# Altium schematic sheet Power.SchDoc: Power
size A4; DocumentNumber: 8; SheetNumber: 8; SheetTotal: 8
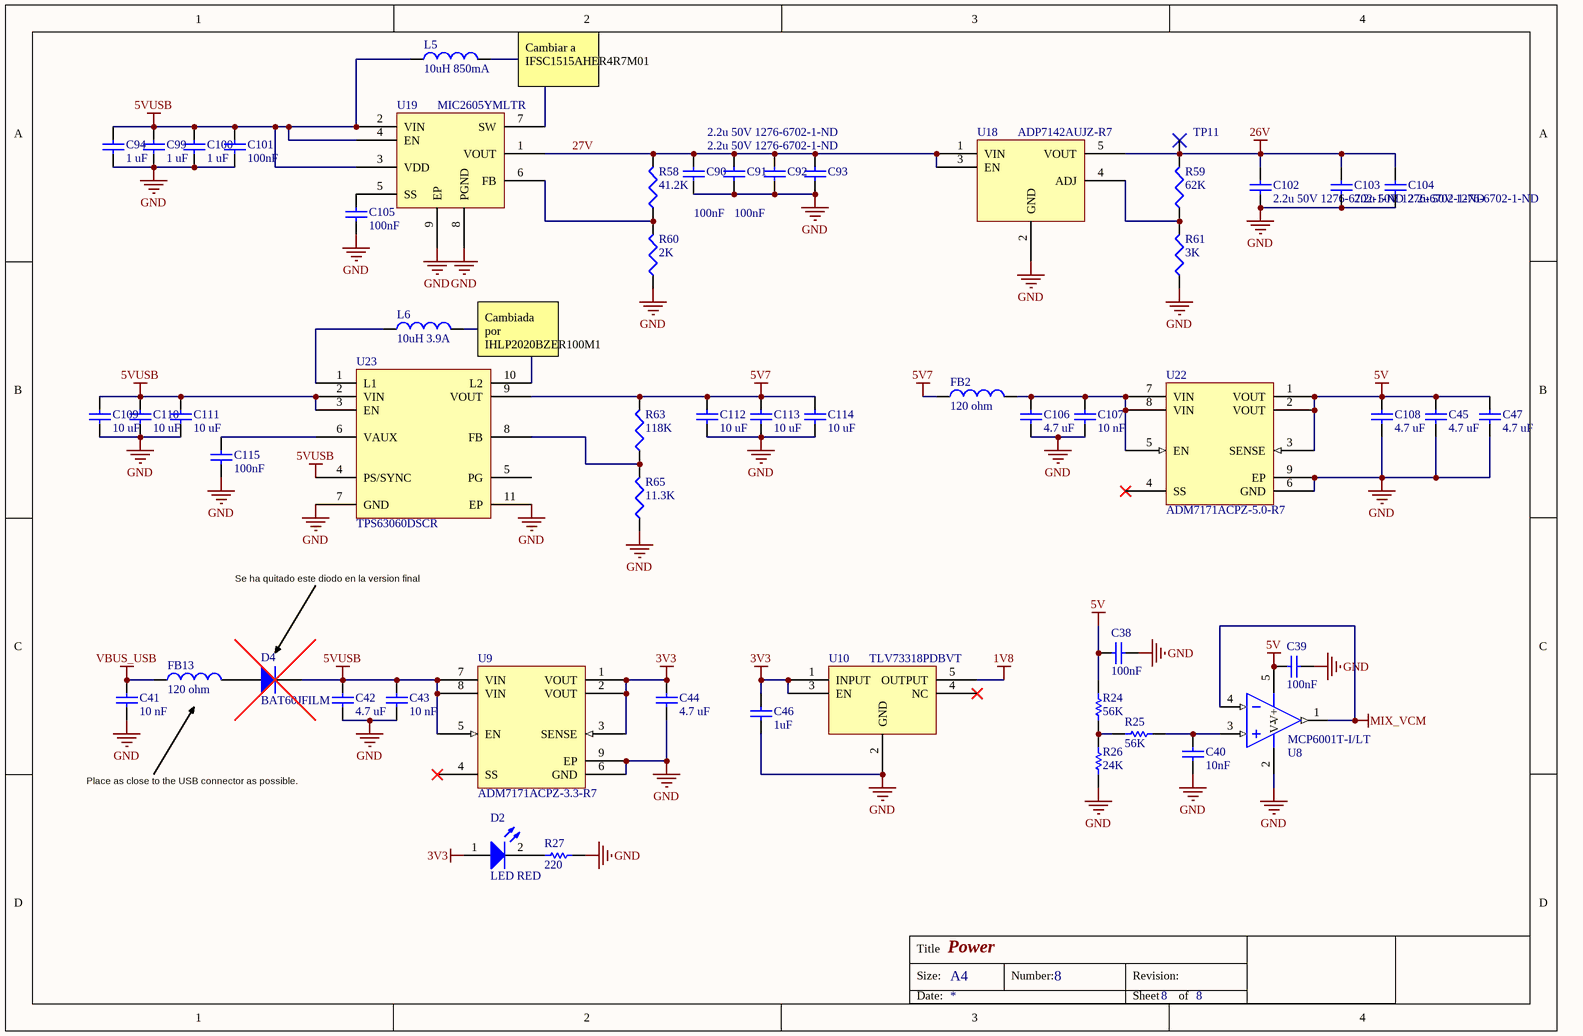
[diagram p0: Power.SchDoc]

## Parts
C38  100nF  [0603 Cap]
C39  100nF  [0603 Cap]
C40  10nF  [0603 Cap]
C41  10 nF  [Chip2PinSM127P600-8N_CAP0402]
C42  4.7 uF  [CAPC1608X10L]
C43  10 nF  [Chip2PinSM127P600-8N_CAP0402]
C44  4.7 uF  [CAPC1608X10L]
C45  4.7 uF  [CAPC1608X10L]
C46  1uF  [0603 Cap]
C47  4.7 uF  [CAPC1608X10L]
C90  100nF  [0603 Cap]
C91  100nF  [0603 Cap]
C92  2.2u 50V 1276-6702-1-ND  [0805 CAP]
C93  2.2u 50V 1276-6702-1-ND  [0805 CAP]
C94  1 uF  [CAPC2012X08L]
C99  1 uF  [CAPC2012X08L]
C100  1 uF  [CAPC2012X08L]
C101  100nF  [0603 Cap]
C102  2.2u 50V 1276-6702-1-ND  [0805 CAP]
C103  2.2u 50V 1276-6702-1-ND  [0805 CAP]
C104  2.2u 50V 1276-6702-1-ND  [0805 CAP]
C105  100nF  [0603 Cap]
C106  4.7 uF  [CAPC1608X10L]
C107  10 nF  [Chip2PinSM127P600-8N_CAP0402]
C108  4.7 uF  [CAPC1608X10L]
C109  10 uF  [CAPC2012X08L]
C110  10 uF  [CAPC2012X08L]
C111  10 uF  [CAPC2012X08L]
C112  10 uF  [CAPC2012X08L]
C113  10 uF  [CAPC2012X08L]
C114  10 uF  [CAPC2012X08L]
C115  100nF  [0603 Cap]
D2  LED RED  [0603 LED]
D4  BAT60JFILM  [SODFL250X117-2N]
FB2  120 ohm  [INDC1608X08L]
FB13  120 ohm  [INDC1608X08L]
L5  10uH 850mA  [INDP4040X20N]
L6  10uH 3.9A  [INDP8080X45N]
R24  56K  [0603 Res]
R25  56K  [0603 Res]
R26  24K  [0603 Res]
R27  220  [0603 Res]
R58  41.2K  [J1-0603]
R59  62K  [J1-0603]
R60  2K  [J1-0603]
R61  3K  [J1-0603]
R63  118K  [J1-0603]
R65  11.3K  [J1-0603]
TP11  TEST_POINT_PIN  [TESTPOINT 1mm]  (value not drawn)  (no BOM)
U8  MCP6001T-I/LT  [SC70P210X110-5L]
U9  ADM7171ACPZ-3.3-R7  [SON50P300X80_HS-9N LFCSP_WD Analog]
U10  TLV73318PDBVT  [SOT95P280X110-5N]
U18  ADP7142AUJZ-R7  [SOT95P280X90-5N]
U19  MIC2605YMLTR  [SON50P200X90_HS-9N]
U22  ADM7171ACPZ-5.0-R7  [SON50P300X80_HS-9N LFCSP_WD Analog]
U23  TPS63060DSCR  [SON50P300X80_HS-11N]

## Nets
1V8: U10.5(OUTPUT)
3V3: C44.2 C46.2 D2.1(A) U9.1(VOUT) U9.2(VOUT) U9.3(SENSE) U10.1(INPUT) U10.3(EN)
5V: C38.1 C39.1 C45.2 C47.2 C108.2 R24.2 U8.5(V+) U22.1(VOUT) U22.2(VOUT) U22.3(SENSE)
5V7: C112.2 C113.2 C114.2 FB2.1 R63.2 U23.9(VOUT)
5VUSB: C42.2 C43.2 C94.2 C99.2 C100.2 C101.2 C109.1 C110.2 C111.2 D4.1(K) L5.1 U9.5(EN) U9.7(VIN) U9.8(VIN) U19.2(VIN) U19.3(VDD) U19.4(EN) U23.2(VIN) U23.3(EN) U23.4(PS/SYNC)
26V: C102.2 C103.2 C104.2 R59.2 TP11.1 U18.5(VOUT)
GND: C38.2 C39.2 C40.1 C41.1 C42.1 C43.1 C44.1 C45.1 C46.1 C47.1 C90.1 C91.1 C92.1 C93.1 C94.1 C99.1 C100.1 C101.1 C102.1 C103.1 C104.1 C105.1 C106.1 C107.1 C108.1 C109.2 C110.1 C111.1 C112.1 C113.1 C114.1 C115.1 R26.1 R27.2 R60.1 R61.1 R65.1 U8.2(V-) U9.6(GND) U9.9(EP) U10.2(GND) U18.2(GND) U19.8(PGND) U19.9(EP) U22.6(GND) U22.9(EP) U23.7(GND) U23.11(EP)
MIX_VCM: U8.1(OUT) U8.4(IN-)
VBUS_USB: C41.2 FB13.1
27V: C90.2 C91.2 C92.2 C93.2 R58.2 U18.1(VIN) U18.3(EN) U19.1(VOUT)
NetC40_2: C40.2 R25.1 U8.3(IN+)
NetC105_2: C105.2 U19.5(SS)
NetC106_2: C106.2 C107.2 FB2.2 U22.5(EN) U22.7(VIN) U22.8(VIN)
NetC115_2: C115.2 U23.6(VAUX)
NetD2_2: D2.2(C) R27.1
NetD4_2: D4.2(A) FB13.2
NetL5_2: L5.2 U19.7(SW)
NetL6_1: L6.1 U23.1(L1)
NetL6_2: L6.2 U23.10(L2)
NetR24_1: R24.1 R25.2 R26.2
NetR58_1: R58.1 R60.2 U19.6(FB)
NetR59_1: R59.1 R61.2 U18.4(ADJ)
NetR63_1: R63.1 R65.2 U23.8(FB)

Not connected (* = marked no-connect by the designer): U9 4(SS)*; U10 4(NC)*; U22 4(SS)*; U23 5(PG)

## Notes on the sheet
- Cambiar a IFSC1515AHER4R7M01
- Cambiada por IHLP2020BZER100M1
- Se ha quitado este diodo en la version final
- Place as close to the USB connector as possible.
- Title
- Size:
- A4
- Number:
- Revision:
- Date:
- Sheet
- of

## Library data of the parts
C38-C40 = C_0603: CAP CER 16V X7R 0603; Tolerance: 10; Voltage Rating: 16; Material: Ceramic; Mount: Surface Mount; Case/Package: 0603; Case Code (Metric): 1608; Case Code (Imperial): 0603; Capacitance: *; Dielectric: X7R; Voltage Rating (DC): 16; Termination: SMD; Composition: Ceramic; Voltage: 16; Length: 1.6; Height: 0.8; Width: 0.8; Thickness: 0.035; Depth: 0.8
C41 C43 C107 = CL05B103KA5NNNC: CAP CER 10000PF 25V X7R 0402; Manufacturer: Samsung Electro-Mechanics America, Inc.; Tolerance: ±10%; Supplier 1: Digi-Key; Manufacturer Part Number: CL05B103KA5NNNC; RoHS: RoHS Compliant; Category: Capacitors; Stock 1: 615673; Pricing 1: 1=0.09, 10=0.009, 25=0.006, 50=0.0044, 100=0.0037, 250=0.00308, 500=0.00266, 1000=0.00208, 5000=0.00174 (EUR); Packaging: Cut Tape (CT); Part Status: Active; Capacitance: 10000pF; Voltage - Rated: 25V; Temperature Coefficient: X7R; Operating Temperature: -55°C ~ 125°C; Features: -; Ratings: -; Applications: General Purpose; Mounting Type: Surface Mount, MLCC; Package / Case: 0402 (1005 Metric); Size / Dimension: 0.039" L x 0.020" W (1.00mm x 0.50mm); Height - Seated (Max): -; Thickness (Max): 0.022" (0.55mm); Lead Spacing: -; Lead Style: -; ComponentLink1URL: http://www.samsungsem.com/kr/support/product-search/mlcc/__icsFiles/afieldfile/2016/08/18/S_CL05B103KA5NNNC.pdf; ComponentLink1Description: http://www.samsungsem.com/kr/support/product-search/mlcc/__icsFiles/afieldfile/2016/08/18/S_CL05B103KA5NNNC.pdf; Supplier Part Number 1: 1276-1057-1-ND
C42 C44 C45 C47 C106 C108 = GRM188R61C475KAAJD: Multilayer Ceramic Capacitors MLCC - SMD/SMT 0603 4.7uF 16volts X5R + - 10%; Manufacturer: Murata Electronics; Type: General Purpose MLCC; Voltage Rating DC: 16 V; Product Status: New Product; Voltage - Rated: 16V; Supplier 1: Mouser; Manufacturer Part Number: GRM188R61C475KAAJD; RoHS: RoHS Compliant; Category: Multilayer Ceramic Capacitors MLCC - SMD/SMT; Stock 1: 10870; Pricing 1: 1=0.262, 10=0.110, 100=0.066, 1000=0.056, 4000=0.042, 8000=0.040, 24000=0.037, 48000=0.035, 100000=0.030 (EUR); Capacitance: 4.7 uF; Height: 0.8 mm; Length: 1.6 mm; Package/Case: 0603 (1608 metric); Packaging: Reel; Product: General Type MLCCs; Series: GRM; Termination Style: SMD/SMT; Tolerance: 10 %; Width: 0.8 mm; Brand: Murata Electronics; Case Code - in: 0603; Case Code - mm: 1608; Dielectric: X5R; Maximum Operating Temperature: + 85 C; Minimum Operating Temperature: - 55 C; RoHS - Mouser: Y; Minimum Order Quantity: 1; Reeling: True; ComponentLink1URL: http://www.mouser.com/ds/2/281/c02e-2905.pdf; ComponentLink1Description: http://www.mouser.com/ds/2/281/c02e-2905.pdf; Supplier 2: Digi-Key; Stock 2: 0; Pricing 2: 1=0.27, 10=0.224, 25=0.154, 50=0.1262, 100=0.112, 250=0.08404, 500=0.07424, 1000=0.06582 (EUR); Temperature Coefficient: X5R; Mounting Type: Surface Mount, MLCC; Operating Temperature: -55°C ~ 85°C; Applications: General Purpose; Ratings: -; Package / Case: 0603 (1608 Metric); Size / Dimension: 0.063" L x 0.031" W (1.60mm x 0.80mm); Height - Seated (Max): -; Thickness (Max): 0.037" (0.95mm); Lead Spacing: -; Features: -; Lead Style: -; ComponentLink2URL: http://www.murata.com/~/media/webrenewal/support/library/catalog/products/capacitor/mlcc/c02e.ashx; ComponentLink2Description: http://www.murata.com/~/media/webrenewal/support/library/catalog/products/capacitor/mlcc/c02e.ashx; Supplier Part Number 1: 81-GRM188R61C475KAJD; Supplier Part Number 2: 490-10481-1-ND
C46 = CL10B105MO8NNWC: CAP CER 1UF 16V X7R 0603; Manufacturer: Samsung Electro-Mechanics America, Inc.; Capacitance: 1µF; Tolerance: ±20%; Supplier 1: Digi-Key; Manufacturer Part Number: CL10B105MO8NNWC; RoHS: RoHS Compliant; Category: Capacitors; Stock 1: 77746; Pricing 1: 1=0.09, 10=0.02, 25=0.0144, 50=0.0108, 100=0.0089, 250=0.00744, 500=0.00636, 1000=0.00499 (EUR); Packaging: Digi-Reel®; Part Status: Active; Voltage - Rated: 16V; Temperature Coefficient: X7R; Operating Temperature: -55°C ~ 125°C; Features: -; Ratings: -; Applications: General Purpose; Mounting Type: Surface Mount, MLCC; Package / Case: 0603 (1608 Metric); Size / Dimension: 0.063" L x 0.031" W (1.60mm x 0.80mm); Height - Seated (Max): -; Thickness (Max): 0.035" (0.90mm); Lead Spacing: -; Lead Style: -; ComponentLink1URL: http://www.samsungsem.com/kr/support/library/product-catalog/__icsFiles/afieldfile/2016/09/27/MLCC.pdf; ComponentLink1Description: http://www.samsungsem.com/kr/support/library/product-catalog/__icsFiles/afieldfile/2016/09/27/MLCC.pdf; Supplier Part Number 1: 1276-6524-6-ND
C90 C91 C101 C105 C115 = C0603C104K4RACTU: CAP CER 0.1UF 16V X7R 0603; Manufacturer: KEMET; Capacitance: 0.1µF; Tolerance: ±10%; Supplier 1: Digi-Key; Manufacturer Part Number: C0603C104K4RACTU; RoHS: RoHS Compliant; Category: Capacitors; Stock 1: 4491346; Pricing 1: 1=0.09, 10=0.022, 25=0.016, 50=0.0122, 100=0.01, 250=0.00836, 500=0.0071, 1000=0.00559 (EUR); Packaging: Digi-Reel®; Part Status: Active; Voltage - Rated: 16V; Temperature Coefficient: X7R; Operating Temperature: -55°C ~ 125°C; Features: -; Ratings: -; Applications: General Purpose; Failure Rate: -; Mounting Type: Surface Mount, MLCC; Package / Case: 0603 (1608 Metric); Size / Dimension: 0.063" L x 0.031" W (1.60mm x 0.80mm); Height - Seated (Max): -; Thickness (Max): 0.034" (0.87mm); Lead Spacing: -; Lead Style: -; ComponentLink1URL: http://www.kemet.com/docfinder?Partnumber=C0603C104K4RACTU; ComponentLink1Description: http://www.kemet.com/docfinder?Partnumber=C0603C104K4RACTU; Supplier Part Number 1: 399-1096-6-ND
C92 C93 C102-C104 = C0805C335K4PACTU: Multilayer Ceramic Capacitors MLCC - SMD/SMT 16volts 3.3uF X5R 10%; Manufacturer: Kemet; Capacitance: 3.3; Tolerance: 10; Voltage Rating (DC): 16; Dissipation Factor: 5; Supplier 1: Digikey; Manufacturer Part Number: C0805C335K4PACTU; Stock 1: 7901; Pricing 1: 1=0.4, 10=0.281, 25=0.2304, 50=0.1966, 100=0.1685, 250=0.1404, 500=0.1263, 1000=0.1067 (USD); Mount: Surface Mount; Case/Package: 0805; Case Code (Metric): 2012; Case Code (Imperial): 0805; Min Operating Temperature: -55; Max Operating Temperature: 85; Packaging: Tape and Reel; Dielectric: X5R; Voltage Rating: 16; Package Quantity: 2500; Lead Pitch: 0.75; Termination: SMD; Voltage: 16; Length: 2; Height: 1.25; Depth: 1.25; Width: 0.049; Thickness: 0.055; Radiation Hardening: No; Lead Free: Lead Free; REACH SVHC: No SVHC; ComponentLink1URL: https://datasheet.ciiva.com/22705/1847039-22705464.pdf; ComponentLink1Description: https://datasheet.ciiva.com/22705/1847039-22705464.pdf; ComponentLink2URL: https://datasheet.ciiva.com/7842/1847039-7842327.pdf; ComponentLink2Description: https://datasheet.ciiva.com/7842/1847039-7842327.pdf; Supplier Part Number 1: 399-8073-1-ND
C94 C99 C100 = CL21B105KAFNNNE: CAP CER 1UF 25V 10% X7R 0805; Manufacturer: Samsung Electro-Mechanics America, Inc; Capacitance: 1.0µF; Supplier 1: Digi-Key; Supplier Part Number 1: 1276-1066-1-ND; Manufacturer Part Number: CL21B105KAFNNNE; RoHS: RoHS Compliant; Category: Capacitors; Stock 1: 446779; Pricing 1: 1=0.11, 10=0.077, 25=0.054, 100=0.0349, 500=0.02446, 1000=0.01906 (EUR); Packaging: Cut Tape (CT); Tolerance: ±10%; Voltage - Rated: 25V; Temperature Coefficient: X7R; Mounting Type: Surface Mount, MLCC; Operating Temperature: -55°C ~ 125°C; Applications: General Purpose; Ratings: -; Package / Case: 0805 (2012 Metric); Size / Dimension: 0.079" L x 0.049" W (2.00mm x 1.25mm); Height - Seated (Max): -; Thickness (Max): 0.053" (1.35mm); Lead Spacing: -; Features: -; Lead Style: -; ComponentLink1URL: http://www.samsungsem.com/servlet/FileDownload?type=spec&file=CL21B105KAFNNNE.pdf; ComponentLink1Description: http://www.samsungsem.com/servlet/FileDownload?type=spec&file=CL21B105KAFNNNE.pdf
C109-C114 = CL21A106KAYNNNE: CAP CER 10UF 25V 10% X5R 0805; Manufacturer: Samsung Electro-Mechanics America, Inc; Capacitance: 10µF; Supplier 1: Digi-Key; Supplier Part Number 1: 1276-2891-1-ND; Manufacturer Part Number: CL21A106KAYNNNE; RoHS: RoHS Compliant; Category: Capacitors; Stock 1: 406675; Pricing 1: 1=0.22, 10=0.18, 25=0.124, 100=0.0901, 500=0.0597, 1000=0.05293 (EUR); Packaging: Cut Tape (CT); Tolerance: ±10%; Voltage - Rated: 25V; Temperature Coefficient: X5R; Mounting Type: Surface Mount, MLCC; Operating Temperature: -55°C ~ 85°C; Applications: General Purpose; Ratings: -; Package / Case: 0805 (2012 Metric); Size / Dimension: 0.079" L x 0.049" W (2.00mm x 1.25mm); Height - Seated (Max): -; Thickness (Max): 0.057" (1.45mm); Lead Spacing: -; Features: -; Lead Style: -; ComponentLink1URL: http://www.samsungsem.com/servlet/FileDownload?type=spec&file=CL21A106KAYNNNE.pdf; ComponentLink1Description: http://www.samsungsem.com/servlet/FileDownload?type=spec&file=CL21A106KAYNNNE.pdf
D2 = LTST-C191KRKT: LED RED CLEAR 0603 SMD; Manufacturer: Lite-On Inc.; Lens Color: Colorless; Millicandela Rating: 54mcd; Lens Style/Size: Rectangle with Flat Top, 1.10mm x 0.80mm; Voltage - Forward (Vf) (Typ): 2V; Current - Test: 20mA; Viewing Angle: 130°; Wavelength - Dominant: 631nm; Wavelength - Peak: 639nm; Supplier 1: Digi-Key; Manufacturer Part Number: LTST-C191KRKT; RoHS: RoHS Compliant; Category: Optoelectronics; Stock 1: 517799; Pricing 1: 1=0.27, 10=0.197, 25=0.1456, 100=0.1039, 250=0.07068, 500=0.06234, 1000=0.04884, 2500=0.0478 (EUR); Packaging: Digi-Reel®; Part Status: Active; Color: Red; Lens Transparency: Clear; Mounting Type: Surface Mount; Features: -; Package / Case: 0603 (1608 Metric); Size / Dimension: 1.60mm L x 0.80mm W; Height (Max): 0.65mm; ComponentLink1URL: http://optoelectronics.liteon.com/upload/download/DS22-2000-223/S_110_LTST-C191KRKT.pdf; ComponentLink1Description: http://optoelectronics.liteon.com/upload/download/DS22-2000-223/S_110_LTST-C191KRKT.pdf; Supplier Part Number 1: 160-1447-6-ND
D4 = BAT60JFILM: DIODE SCHOTTKY 10V 3A SOD323; Manufacturer: STMicroelectronics; Current - Average Rectified (Io): 3A (DC); Voltage - Forward (Vf) (Max) @ If: 580mV @ 1A; Speed: Fast Recovery =< 500ns, > 200mA (Io); Current - Reverse Leakage @ Vr: 6µA @ 10V; Supplier 1: Digi-Key; Manufacturer Part Number: BAT60JFILM; RoHS: RoHS Compliant; Category: Discrete Semiconductor Products; Stock 1: 49087; Pricing 1: 1=0.36, 10=0.272, 100=0.1539, 500=0.10188, 1000=0.07812 (EUR); Packaging: Cut Tape (CT); Part Status: Active; Diode Type: Schottky; Capacitance @ Vr, F: -; Mounting Type: Surface Mount; Package / Case: SC-76, SOD-323; Supplier Device Package: SOD-323; Operating Temperature - Junction: 150°C (Max); ComponentLink1URL: http://www.st.com/content/ccc/resource/technical/document/datasheet/3d/d2/27/1d/20/e3/4d/48/CD00001944.pdf/files/CD00001944.pdf/jcr:content/translations/en.CD00001944.pdf; ComponentLink1Description: http://www.st.com/content/ccc/resource/technical/document/datasheet/3d/d2/27/1d/20/e3/4d/48/CD00001944.pdf/files/CD00001944.pdf/jcr:content/translations/en.CD00001944.pdf; Supplier Part Number 1: 497-3707-1-ND
FB2 FB13 = BLM18PG121SN1D: FERRITE BEAD 120 OHM 0603 1LN; Manufacturer: Murata Electronics North America; Filter Type: Power Line; Number of Lines: 1; Impedance @ Frequency: 120 Ohm @ 100MHz; Current Rating (Max): 2A; DC Resistance (DCR) (Max): 50 mOhm; Supplier 1: Digi-Key; Manufacturer Part Number: BLM18PG121SN1D; RoHS: RoHS Compliant; Category: Filters; Stock 1: 1305577; Pricing 1: 1=0.09, 10=0.067, 25=0.06, 50=0.0438, 100=0.038, 250=0.02996, 500=0.0253, 1000=0.02132 (EUR); Packaging: Cut Tape (CT); Part Status: Active; Ratings: -; Operating Temperature: -55°C ~ 125°C; Package / Case: 0603 (1608 Metric); Mounting Type: Surface Mount; Height (Max): 0.037" (0.95mm); Size / Dimension: 0.063" L x 0.031" W (1.60mm x 0.80mm); ComponentLink1URL: http://www.murata.com/en-us/products/productdata/8796738650142/ENFA0003.pdf; ComponentLink1Description: http://www.murata.com/en-us/products/productdata/8796738650142/ENFA0003.pdf; Supplier Part Number 1: 490-1037-1-ND
L5 = VLCF4020T-100MR85: FIXED IND 10UH 850MA 185 MOHM; Manufacturer: TDK; Product Training Modules: SMD Inductors; Catalog Drawings: VLCF40(18-2,20,28-2) SeriesTop VLCF40(18-2,20,28-2) SeriesFootprint VLCF4020 Series Side; EDA / CAD Models: Download from Accelerated Designs; Type: Wirewound; Material - Core: Ferrite; Inductance: 10µH; Tolerance: ±20%; Shielding: Shielded; DC Resistance (DCR): 185 mOhm Max; Frequency - Test: 100kHz; Online Catalog: VLCF Series; Other Names: 445-3186-2 / VLCF4020T100MR85; Supplier 1: Digi-Key; Manufacturer Part Number: VLCF4020T-100MR85; Stock 1: 9968; Pricing 1: 1=0.78, 10=0.684, 100=0.4888, 500=0.4106 (USD); Standard Package: 1,000; Category: Inductors, Coils, Chokes; Family: Fixed Inductors; Series: VLCF; Packaging: Tape & Reel (TR); Current Rating: 850mA; Current - Saturation: 850mA; Operating Temperature: -40°C ~ 105°C; Mounting Type: Surface Mount; Package / Case: Nonstandard; Size / Dimension: 0.157" L x 0.157" W (4.00mm x 4.00mm); Height - Seated (Max): 0.079" (2.00mm); ComponentLink1URL: https://datasheet.ciiva.com/22725/321084-22725936.pdf; ComponentLink1Description: https://datasheet.ciiva.com/22725/321084-22725936.pdf; ComponentLink2URL: https://datasheet.ciiva.com/15160/getdatasheetpartid-50492-15160149.pdf; ComponentLink2Description: https://datasheet.ciiva.com/15160/getdatasheetpartid-50492-15160149.pdf; ComponentLink3URL: https://datasheet.ciiva.com/11800/0900766b807a173d-11800455.pdf; ComponentLink3Description: https://datasheet.ciiva.com/11800/0900766b807a173d-11800455.pdf; Supplier Part Number 1: 445-3186-1-ND
L6 = 1217AS-H-100M=P3: Ind Power Shielded 10uH 20% 100KHz Ferrite 3.9A T/R; Manufacturer: Murata; Type: Wirewound; Inductance: 10µH; Current - Saturation: 4.3A; DC Resistance (DCR): 39.6 mOhm Max; Supplier 1: Digi-Key; Manufacturer Part Number: 1217AS-H-100M=P3; Stock 1: 1997; Pricing 1: 1=0.9, 10=0.837, 100=0.6054, 500=0.4637 (USD); Category: Inductors, Coils, Chokes; Family: Fixed Inductors; Series: DEM8045C; Packaging: Tape & Reel (TR); Material - Core: Ferrite; Tolerance: ±20%; Current Rating: 3.9A; Shielding: Shielded; Q @ Freq: -; Frequency - Self Resonant: -; Ratings: -; Operating Temperature: -; Frequency - Test: 100kHz; Mounting Type: Surface Mount; Package / Case: 2-SMD; Size / Dimension: 0.315" L x 0.315" W (8.00mm x 8.00mm); Height - Seated (Max): 0.177" (4.50mm); Supplier Part Number 1: 490-10783-1-ND
R24-R26 = R_0603: SMD Resistor, 1%, 0.1W, 0603; Tolerance: 1; Power Rating: 100; Mount: Surface Mount; Case/Package: 0603; Pins: 2; Case Code (Imperial): 0603; Case Code (Metric): 1608; Termination: SMD; Length: 1.6; Height: 0.45; Width: 0.8; Depth: 0.8
R27 = RC0603FR-07220RL: RES SMD 220 OHM 1% 1/10W 0603; Manufacturer: Yageo; Power (Watts): 0.1W, 1/10W; Temperature Coefficient: ±100ppm/°C; Supplier 1: Digi-Key; Manufacturer Part Number: RC0603FR-07220RL; RoHS: RoHS Compliant; Category: Resistors; Stock 1: 644291; Pricing 1: 1=0.09, 10=0.012, 25=0.0088, 50=0.0066, 100=0.0049, 250=0.00372, 500=0.00296, 1000=0.00218 (EUR); Packaging: Cut Tape (CT); Part Status: Active; Resistance (Ohms): 220; Tolerance: ±1%; Composition: Thick Film; Features: Moisture Resistant; Operating Temperature: -55°C ~ 155°C; Package / Case: 0603 (1608 Metric); Supplier Device Package: 0603; Size / Dimension: 0.063" L x 0.031" W (1.60mm x 0.80mm); Height - Seated (Max): 0.022" (0.55mm); Failure Rate: -; ComponentLink1URL: http://www.yageo.com/documents/recent/PYu-RC_Group_51_RoHS_L_7.pdf; ComponentLink1Description: http://www.yageo.com/documents/recent/PYu-RC_Group_51_RoHS_L_7.pdf; Supplier Part Number 1: 311-220HRCT-ND
R58-R61 R63 R65 = Res3: Resistor; Published: 8-Jun-2000; LatestRevisionDate: 29-May-2009; LatestRevisionNote: IPC-7351 Footprint Added.; PackageReference: J1-0603; Publisher: Altium Limited; PackageDescription: Chip Resistor
TP11 = TEST_POINT_PIN: Test point for single pin
U8 = MCP6001T-I/LT: Operational Amplifiers - Op Amps Single 1.8V 1MHz; Manufacturer: Microchip Technology; Amplifier Type: Low Power Amplifier; Number of Channels: 1 Channel; Shutdown: No Shutdown; CMRR - Common Mode Rejection Ratio: 60 dB; en - Input Voltage Noise Density: 28 nV/sqrt Hz; Ib - Input Bias Current: 1 pA; In - Input Noise Current Density: 0.0006 pA/sqrt Hz; Operating Supply Current: 100 uA; Output Current per Channel: 23 mA; PSRR - Power Supply Rejection Ratio: 86 dB; SR - Slew Rate: 0.6 V/us; Supply Voltage - Max: 5.5 V; Vos - Input Offset Voltage: 4.5 mV; Supplier 1: Mouser; Manufacturer Part Number: MCP6001T-I/LT; RoHS: RoHS Compliant; Category: Operational Amplifiers - Op Amps; Stock 1: 33208; Pricing 1: 1=0.253, 10=0.235, 25=0.190, 100=0.172, 3000=0.172 (EUR); Package/Case: SC-70-5; Packaging: Reel; Product: Operational Amplifiers; Technology: CMOS; Brand: Microchip Technology; Mounting Style: SMD/SMT; GBP - Gain Bandwidth Product: 1 MHz; Maximum Operating Temperature: + 85 C; Minimum Operating Temperature: - 40 C; Product Category: Amplifiers; Standard Pack Qty: 3000; Supply Voltage - Min: 1.8 V; RoHS - Mouser: Y; Minimum Order Quantity: 1; Reeling: True; ComponentLink1URL: http://www.mouser.com/ds/2/268/21733e-41017.pdf; ComponentLink1Description: http://www.mouser.com/ds/2/268/21733e-41017.pdf; Supplier Part Number 1: 579-MCP6001T-I/LT
U9 = ADM7171ACPZ-3.3-R7: IC REG LDO 3.3V 1A 8-LFCSP; Manufacturer: Analog Devices Inc.; Regulator Topology: Positive Fixed; Voltage - Dropout (Typical): 0.084V @ 1A; Number of Regulators: 1; Voltage - Input: Up to 6.5V; Current - Limit (Min): 1.3A; Supplier 1: Digi-Key; Manufacturer Part Number: ADM7171ACPZ-3.3-R7; RoHS: RoHS Compliant; Category: Integrated Circuits (ICs); Stock 1: 1479; Pricing 1: 1=2.96, 10=2.655, 100=2.1757, 500=1.85208 (EUR); Packaging: Cut Tape (CT); Part Status: Active; Voltage - Output: 3.3V; Current - Output: 1A; Operating Temperature: -40°C ~ 125°C; Mounting Type: Surface Mount; Package / Case: 8-WFDFN Exposed Pad, CSP; Supplier Device Package: 8-LFCSP-WD (3x3); ComponentLink1URL: http://www.analog.com/media/en/technical-documentation/data-sheets/ADM7171.pdf; ComponentLink1Description: http://www.analog.com/media/en/technical-documentation/data-sheets/ADM7171.pdf; Supplier Part Number 1: ADM7171ACPZ-3.3-R7CT-ND; .SymbolChecked: *; .FootprintChecked: *; .Critical: *
U10 = TLV73318PDBVT: TEXAS INSTRUMENTS   TLV73318PDBVT   Fixed LDO Voltage Regulator, 1.4V to 5.5V, 122mV Dropout, 1.8Vout, 300mAout, SOT-23-5; Output Voltage: 1 V to 3.3 V; Output Current: 300 mA; Load Regulation: 25 mV; Line Regulation: 1 mV/V; PSRR / Ripple Rejection - Typ: 28 dB; Voltage Regulation Accuracy: 1 %; Unit Weight: 0.000557 oz; Supplier 1: Digi-Key; Manufacturer: Texas Instruments; Manufacturer Part Number: TLV73318PDBVT; Stock 1: 5268; Pricing 1: 1=0.4, 10=0.344, 100=0.2567 (USD); Product Category: LDO Voltage Regulators; RoHS: True; Mounting Style: SMD/SMT; Package / Case: SOT-23-5; Input Voltage MAX: 5.5 V; Output Type: Fixed; Maximum Operating Temperature: + 125 C; Series: TLV73318P; Dropout Voltage: 122 mV; Brand: Texas Instruments; Dropout Voltage - Max: 122 mV; Height: 1.45 mm; Input Voltage MIN: 1.4 V; Length: 3.05 mm; Minimum Operating Temperature: - 40 C; Operating Temperature Range: - 40 C to + 125 C; Packaging: Reel; Product: Low Dropout Regulator; Factory Pack Quantity: 250; Width: 1.75 mm; Supplier Part Number 1: 296-38490-1-ND
U18 = ADP7142AUJZ-R7: LDO Voltage Regulators 40V 200mA LDO adjVo; Manufacturer: Analog Devices; Output Voltage: 1.2 V to 39.8 V; Number of Outputs: 1 Output; Output Type: Adjustable; Load Regulation: 0.002 %/mA; Development Kit: ADP7142UJ-EVALZ; Dropout Voltage - Max: 420 mV; Ib - Input Bias Current: 1 uA; Input Voltage MIN: 2.7 V; Line Regulation: 0.01 %/V; Operating Supply Current: 180 uA; PSRR / Ripple Rejection - Typ: 88 dB; Voltage Regulation Accuracy: 0.8 %; Supplier 1: Digi-Key; Manufacturer Part Number: ADP7142AUJZ-R7; Stock 1: 401; Pricing 1: 1=3, 10=2.697, 100=2.2094, 500=1.8808, 1000=1.5862 (USD); Product Category: LDO Voltage Regulators; RoHS: True; Mounting Style: SMD/SMT; Package / Case: TSOT-25-5; Output Current: 200 mA; Input Voltage MAX: 40 V; Maximum Operating Temperature: + 125 C; Series: ADP7142; Brand: Analog Devices; Minimum Operating Temperature: - 40 C; Packaging: Reel; Product: LDO Regulators; Factory Pack Quantity: 3000; Type: CMOS Linear Voltage Regulator; ComponentLink1URL: http://www.mouser.com/ds/2/609/ADP7142-878904.pdf; ComponentLink1Description: http://www.mouser.com/ds/2/609/ADP7142-878904.pdf; ComponentLink2URL: http://www.analog.com/static/imported-files/data_sheets/ADP7142.pdf; ComponentLink2Description: http://www.analog.com/static/imported-files/data_sheets/ADP7142.pdf; ComponentLink3URL: http://www.analog.com/media/en/technical-documentation/data-sheets/ADP7142.pdf; ComponentLink3Description: http://www.analog.com/media/en/technical-documentation/data-sheets/ADP7142.pdf; Supplier Part Number 1: ADP7142AUJZ-R7CT-ND
U19 = MIC2605YMLTR: Boost Switching Regulator IC Positive Adjustable 4.5V 1 Output 500mA (Switch) 8-VFDFN Exposed Pad, 8-MLF®; Manufacturer: Microchip Micrel; Function: Step-Up; Number of Outputs: 1; Voltage - Input (Max): 20V; Voltage - Output (Max): 40V (Switch); Frequency - Switching: 1.2MHz; Synchronous Rectifier: No; Supplier 1: Digi-Key; Manufacturer Part Number: MIC2605YMLTR; Stock 1: 6517; Pricing 1: 1=1.12, 25=0.9372, 100=0.8446 (USD); Category: Integrated Circuits (ICs); Family: PMIC - Voltage Regulators - DC DC Switching Regulators; Series: -; Packaging: Tape & Reel (TR); Output Configuration: Positive; Topology: Boost; Output Type: Adjustable; Voltage - Input (Min): 4.5V; Voltage - Output (Min/Fixed): 4.5V; Current - Output: 500mA (Switch); Operating Temperature: -40°C ~ 125°C (TJ); Mounting Type: Surface Mount; Package / Case: 8-VFDFN Exposed Pad, 8-MLF®; Supplier Device Package: 8-MLF® (2x2); ComponentLink1URL: https://datasheet.ciiva.com/2028/mic2605-2028432.pdf; ComponentLink1Description: https://datasheet.ciiva.com/2028/mic2605-2028432.pdf; ComponentLink2URL: https://datasheet.ciiva.com/26909/getdatasheetpartid-131450-26909717.pdf; ComponentLink2Description: https://datasheet.ciiva.com/26909/getdatasheetpartid-131450-26909717.pdf; ComponentLink3URL: https://datasheet.ciiva.com/16364/mic2605-16364795.pdf; ComponentLink3Description: https://datasheet.ciiva.com/16364/mic2605-16364795.pdf; ComponentLink4URL: https://datasheet.ciiva.com/2028/mic2605-2028430.pdf; ComponentLink4Description: https://datasheet.ciiva.com/2028/mic2605-2028430.pdf; ComponentLink5URL: https://datasheet.ciiva.com/2028/mic2605-2028431.pdf; ComponentLink5Description: https://datasheet.ciiva.com/2028/mic2605-2028431.pdf; Supplier Part Number 1: 576-3258-1-ND
U22 = ADM7171ACPZ-5.0-R7: LDO Regulator Pos 5V 1A 8-Pin LFCSP T/R; Manufacturer: Analog Devices; Input Voltage Range: 2.3 to 6.5 V; Number of Outputs: 1; Line Regulation: 0.1 %/V; Output Type: Fixed; Maximum Input Voltage: 6.5 V; Typical Quiescent Current: 0.7 mA; Polarity: Positive; Load Regulation: 0.1 %/A; Minimum Input Voltage: 2.3 V; Screening Level: Extended Industrial; Junction to Case: 23.5 C/W; Maximum Dropout Voltage @ Current: 0.07@500mA|0.135@1A V; Accuracy: -0.5|1 %; Junction to Ambient: 36.4 C/W; Maximum Quiescent Current: 2 mA; Supplier 1: Digi-Key; Manufacturer Part Number: ADM7171ACPZ-5.0-R7; Stock 1: 574; Pricing 1: 1=3.25, 10=2.917, 100=2.3901, 500=2.0347 (USD); Output Voltage: 5 V; Mounting: Surface Mount; Function: LDO; Operating Temperature: -40 to 125 C; Maximum Output Current: 1 A; ComponentLink1URL: http://www.analog.com/static/imported-files/data_sheets/ADM7171.pdf; ComponentLink1Description: http://www.analog.com/static/imported-files/data_sheets/ADM7171.pdf; ComponentLink2URL: http://www.analog.com/media/en/technical-documentation/data-sheets/ADM7171.pdf; ComponentLink2Description: http://www.analog.com/media/en/technical-documentation/data-sheets/ADM7171.pdf; Supplier Part Number 1: ADM7171ACPZ-5.0-R7CT-ND
U23 = TPS63060DSCR: IC REG BUCK BOOST ADJ 2A 10WSON; Manufacturer: Texas Instruments; Output Type: Adjustable; Number of Outputs: 1; Voltage - Output: 2.5 V ~ 8 V; Voltage - Input: 2.5 V ~ 12 V; PWM Type: Current Mode; Frequency - Switching: 2.4MHz; Current - Output: 1A; Synchronous Rectifier: Yes; Dynamic Catalog: Buck-Boost IC; Other Names: 296-30204-6; Supplier 1: Digi-Key; Manufacturer Part Number: TPS63060DSCR; Stock 1: 94868; Pricing 1: 1=2.41, 10=2.162, 100=1.7376, 500=1.4276, 1000=1.1829 (USD); Standard Package: 1; Category: Integrated Circuits (ICs); Family: PMIC - Voltage Regulators - DC DC Switching Regulators; Series: -; Type: Step-Down (Buck), Step-Up (Boost); Operating Temperature: -40°C ~ 85°C; Mounting Type: Surface Mount; Package / Case: 10-WFDFN Exposed Pad; Packaging: Digi-Reel®; Supplier Device Package: 10-SON Exposed Pad (3x3); ComponentLink1URL: https://datasheet.ciiva.com/4880/slvsa92a-120813-4880993.pdf; ComponentLink1Description: https://datasheet.ciiva.com/4880/slvsa92a-120813-4880993.pdf; ComponentLink2URL: https://datasheet.ciiva.com/7142/1537406-7142908.pdf; ComponentLink2Description: https://datasheet.ciiva.com/7142/1537406-7142908.pdf; ComponentLink3URL: https://datasheet.ciiva.com/2025/tps63060-2025734.pdf; ComponentLink3Description: https://datasheet.ciiva.com/2025/tps63060-2025734.pdf; ComponentLink4URL: https://datasheet.ciiva.com/2025/tps63060-2025735.pdf; ComponentLink4Description: https://datasheet.ciiva.com/2025/tps63060-2025735.pdf; ComponentLink5URL: https://datasheet.ciiva.com/7994/1882359-7994055.pdf; ComponentLink5Description: https://datasheet.ciiva.com/7994/1882359-7994055.pdf; ComponentLink6URL: https://datasheet.ciiva.com/2025/tps63060-2025736.pdf; ComponentLink6Description: https://datasheet.ciiva.com/2025/tps63060-2025736.pdf; ComponentLink7URL: https://datasheet.ciiva.com/14377/tps63060-14377242.pdf; ComponentLink7Description: https://datasheet.ciiva.com/14377/tps63060-14377242.pdf; ComponentLink8URL: https://datasheet.ciiva.com/26181/tps63060-26181916.pdf; ComponentLink8Description: https://datasheet.ciiva.com/26181/tps63060-26181916.pdf; Supplier Part Number 1: 296-30204-1-ND